# EAGLE design aeg_driver (EAGLE 9.6.0)
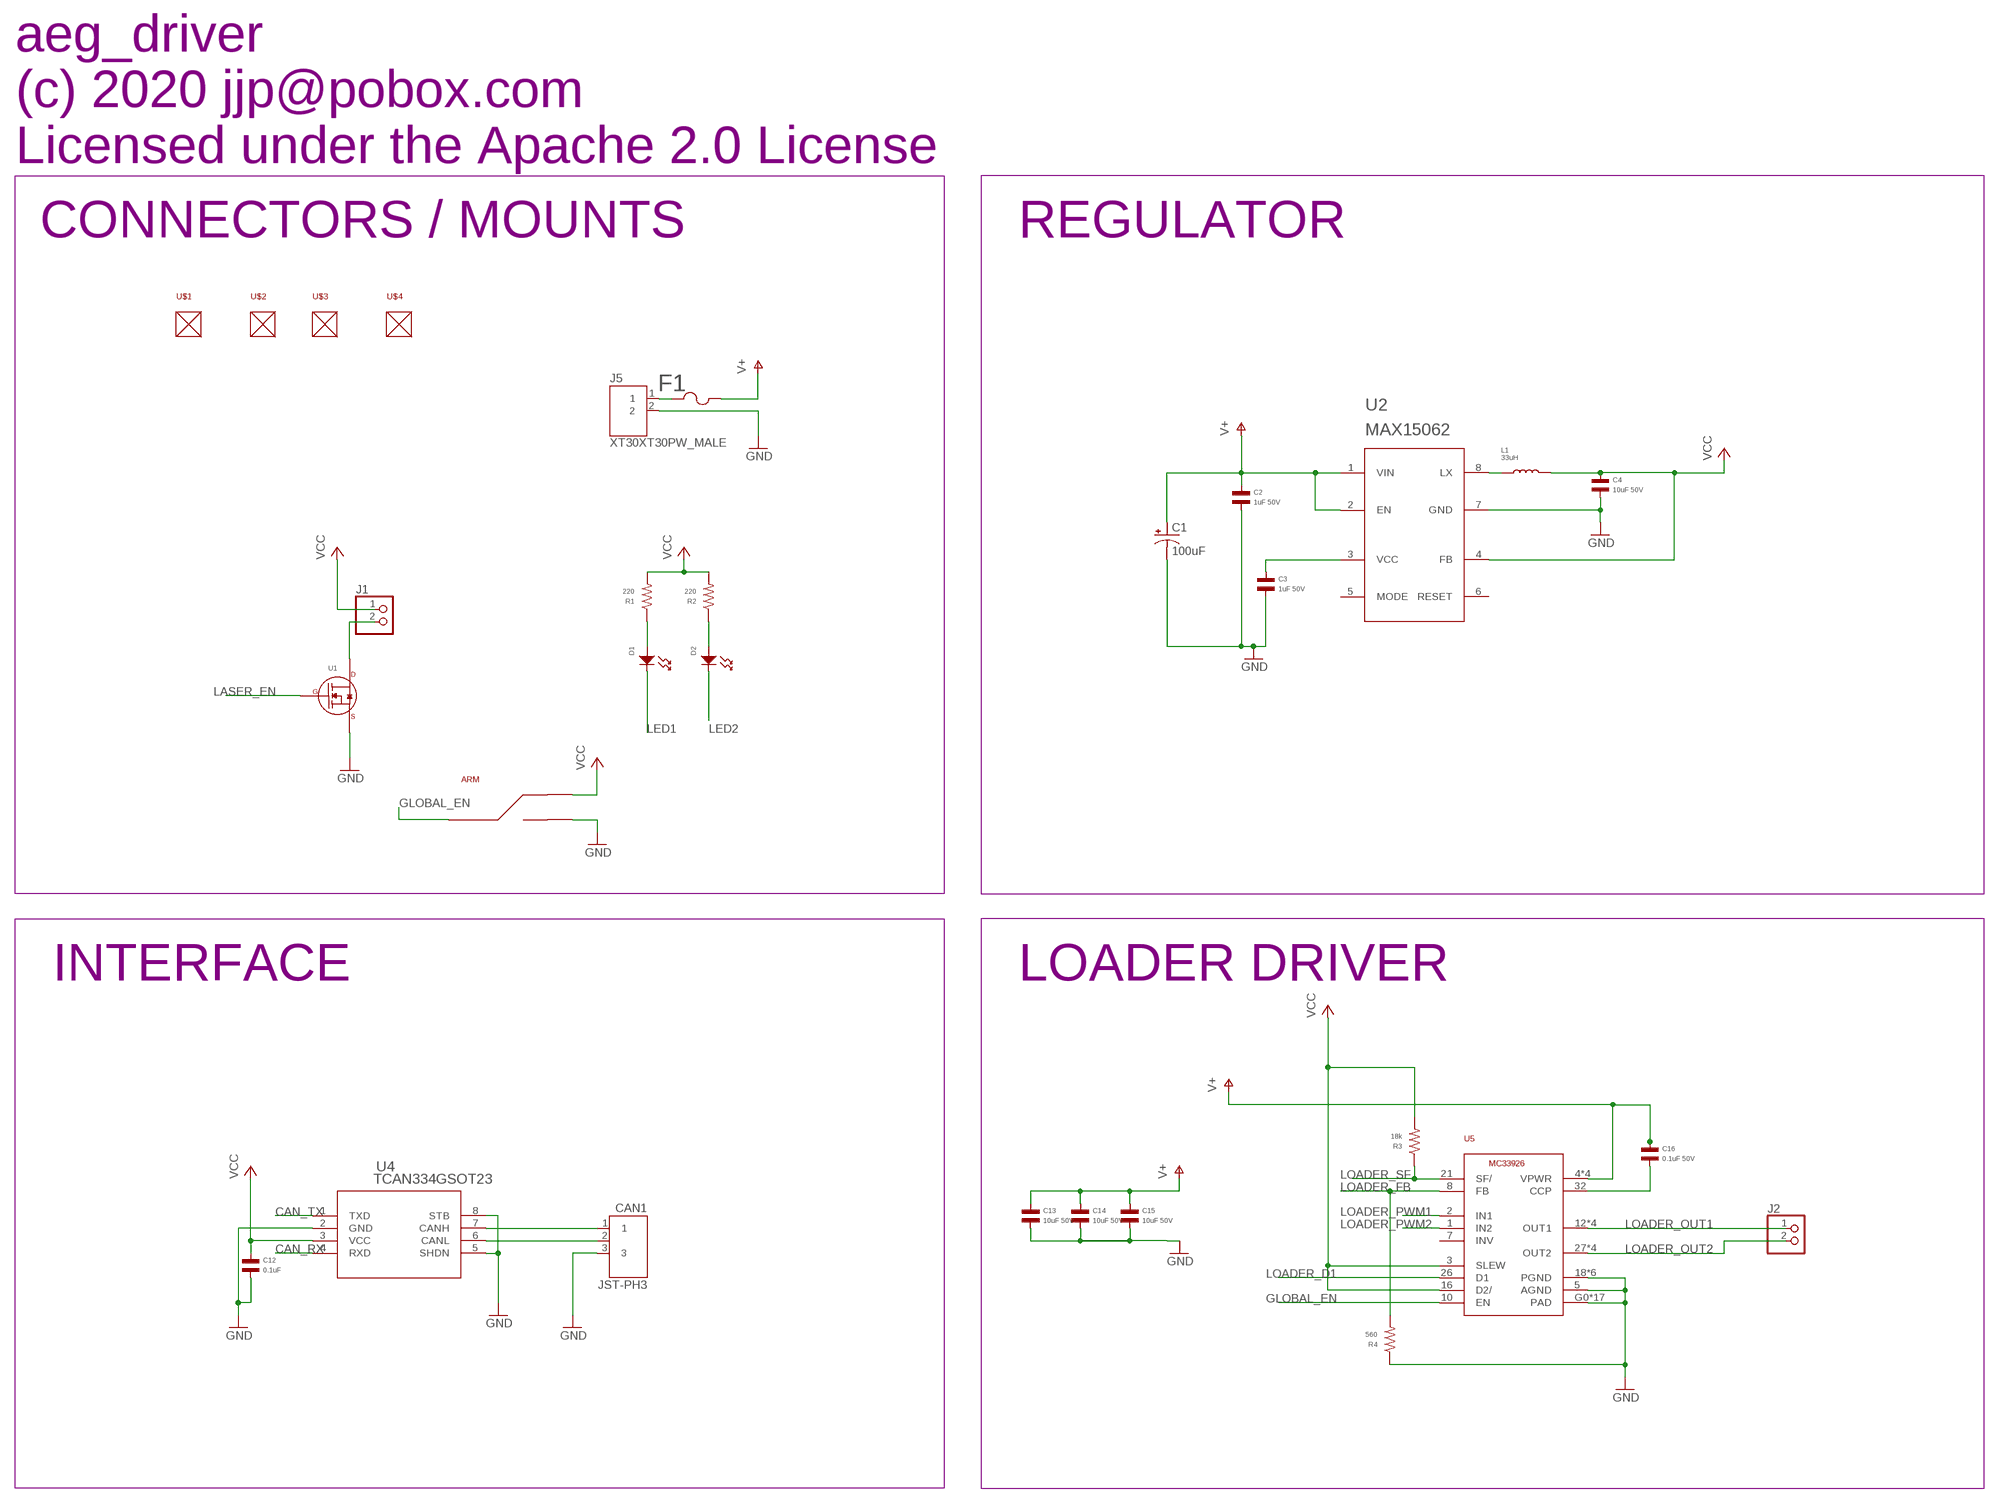
[diagram p0: schematic, sheet 1, part 1 of 2]
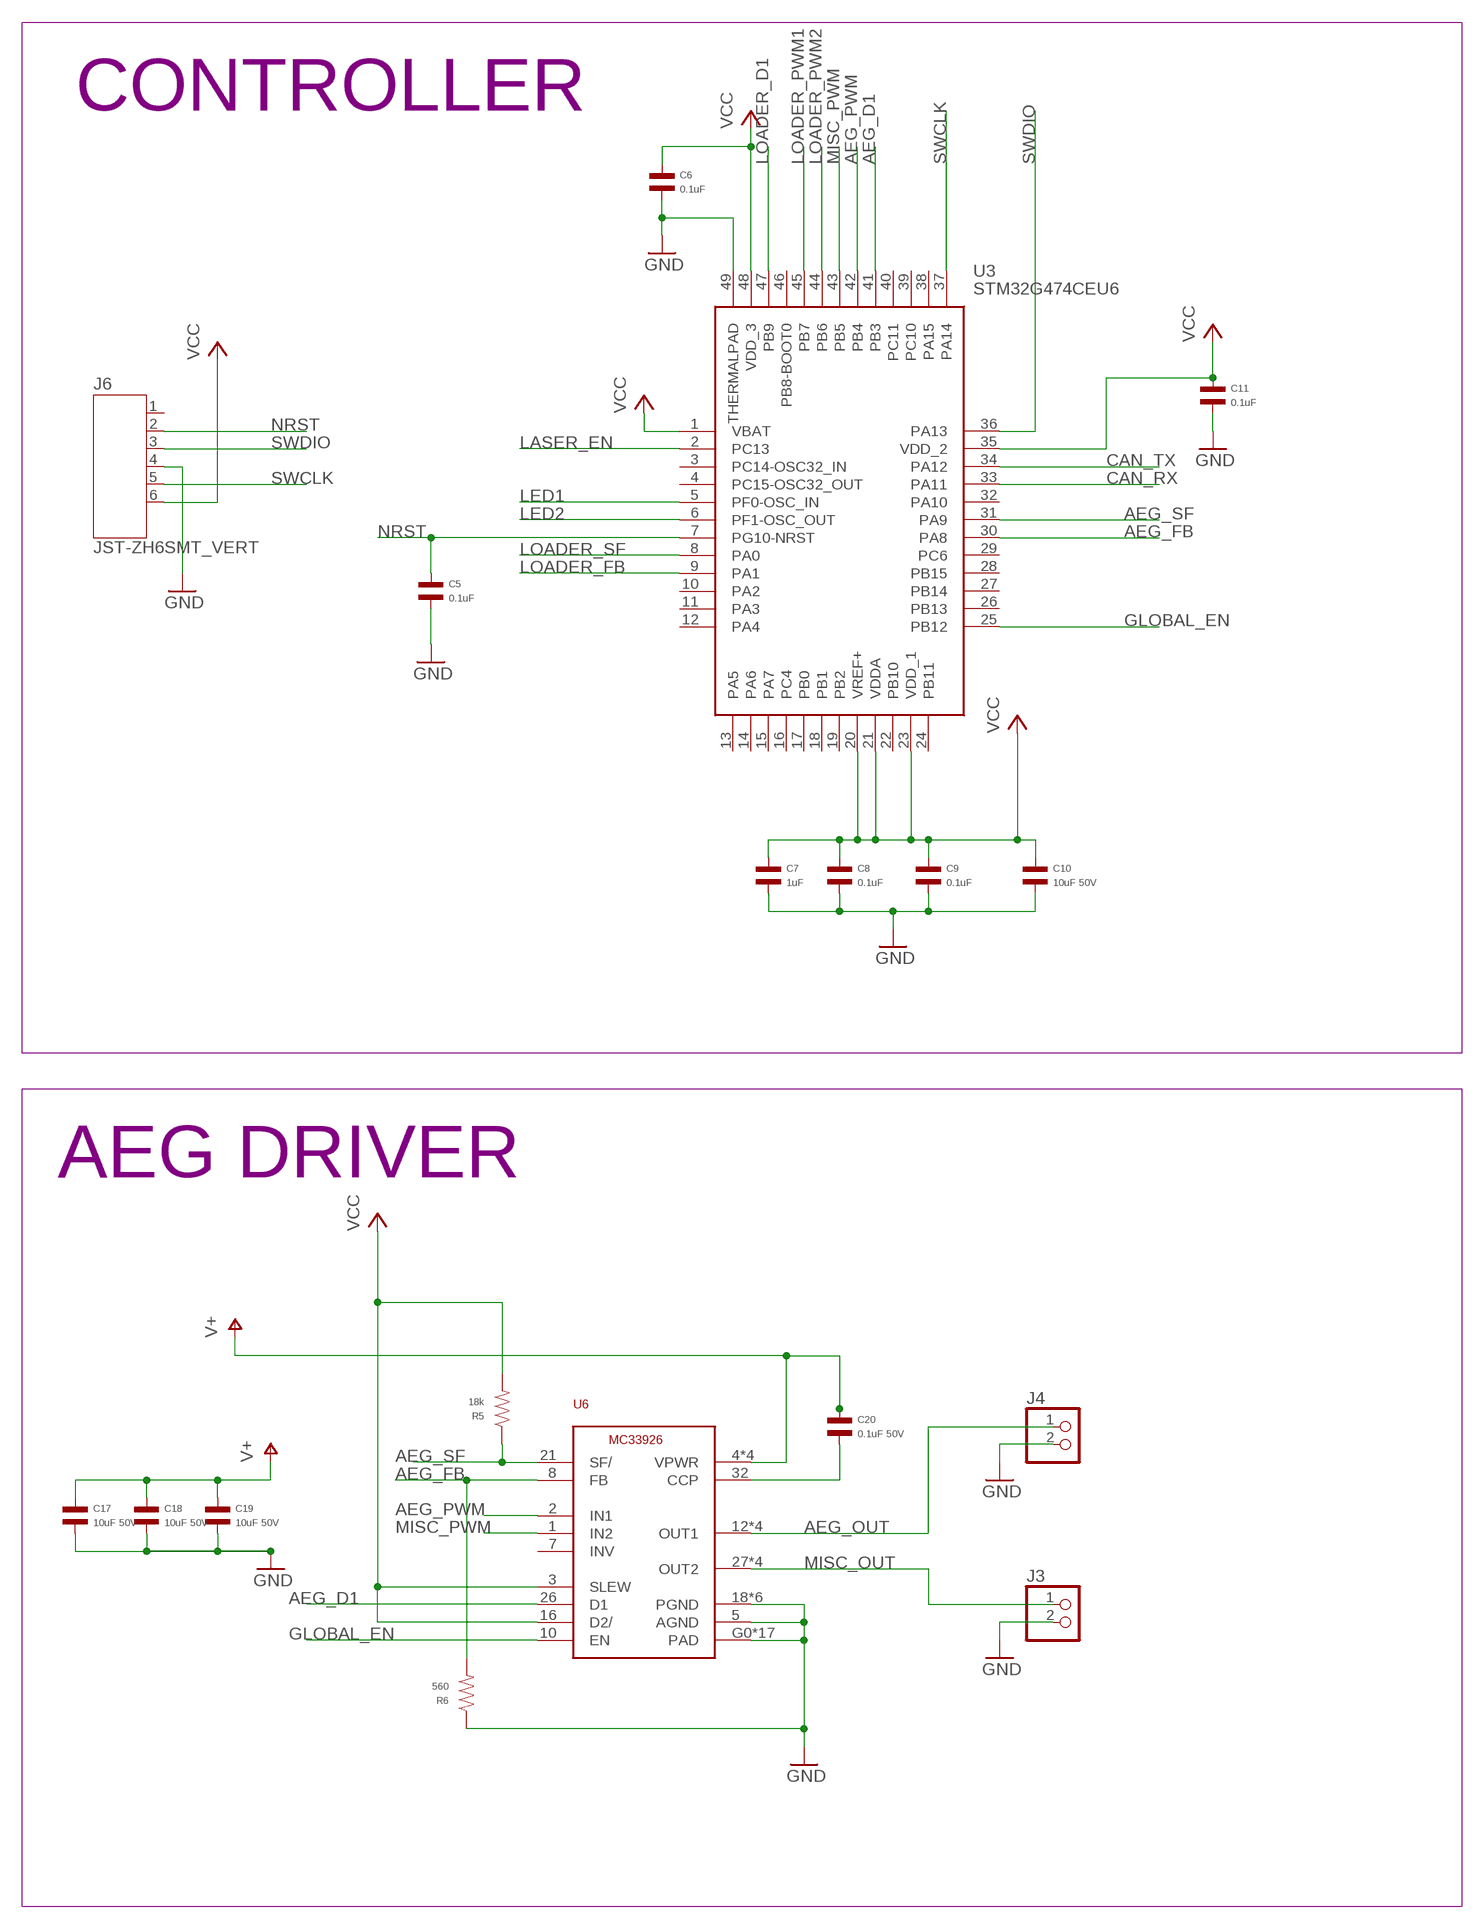
[diagram p1: schematic, sheet 1, part 2 of 2]

## Parts
ARM  SLIDE_SWITCHJS_SUB_SWITCH  [JS_SUB_SWITCH]
C1  100uF  CPOL-USFT_D  [PANASONIC_FT_CAP_D]
C2  1uF 50V  CAPACITOR_NP_0603  [C0603]
C3  1uF 50V  CAPACITOR_NP_0603  [C0603]
C4  10uF 50V  CAPACITOR_NP_1206  [C1206]
C5  0.1uF  CAPACITOR_NP_0402  [C0402]
C6  0.1uF  CAPACITOR_NP_0402  [C0402]
C7  1uF  CAPACITOR_NP_0402  [C0402]
C8  0.1uF  CAPACITOR_NP_0402  [C0402]
C9  0.1uF  CAPACITOR_NP_0402  [C0402]
C10  10uF 50V  CAPACITOR_NP_1206  [C1206]
C11  0.1uF  CAPACITOR_NP_0402  [C0402]
C12  0.1uF  CAPACITOR_NP_0402  [C0402]
C13  10uF 50V  CAPACITOR_NP_1206  [C1206]
C14  10uF 50V  CAPACITOR_NP_1206  [C1206]
C15  10uF 50V  CAPACITOR_NP_1206  [C1206]
C16  0.1uF 50V  CAPACITOR_NP_0402  [C0402]
C17  10uF 50V  CAPACITOR_NP_1206  [C1206]
C18  10uF 50V  CAPACITOR_NP_1206  [C1206]
C19  10uF 50V  CAPACITOR_NP_1206  [C1206]
C20  0.1uF 50V  CAPACITOR_NP_0402  [C0402]
CAN1  JST-PH3  [JST_S3B-PH-SM4-TB(LF)(SN)]
D1  LED_SINGLE-0603-RED  [LED0603]
D2  LED_SINGLE-0603-RED  [LED0603]
F1  MFU0603FF04000P100  [FUS_VISHAY_MFU0603]
J1  PINHD-1X2  [1X02]
J2  PINHD-1X2  [1X02]
J3  PINHD-1X2  [1X02]
J4  PINHD-1X2  [1X02]
J5  XT30XT30PW_MALE  [XT30PW_MALE]
J6  JST-ZH6SMT_VERT  [JST_B6B-ZR-SM4-TF(LF)(SN)]
L1  33uH  INDUCTOR_1210  [L1210]
R1  220  RESISTOR_0603  [R0603]
R2  220  RESISTOR_0603  [R0603]
R3  18k  RESISTOR_0603  [R0603]
R4  560  RESISTOR_0603  [R0603]
R5  18k  RESISTOR_0603  [R0603]
R6  560  RESISTOR_0603  [R0603]
U1  N-CHANNEL_FET_SOT-23-3  [SOT-23-3]
U2  MAX150628TDFN  [8TDFN]
U3  STM32G474CEU6  [QFN50P700X700X60-49N]
U4  TCAN334GSOT23  [SOT23-8]
U5  MC33926  [PQFN32]
U6  MC33926  [PQFN32]
U$1  MOUNT  [M2.5MOUNT]
U$2  MOUNT  [M2.5MOUNT]
U$3  MOUNT  [M2.5MOUNT]
U$4  MOUNT  [M2.5MOUNT]

## Nets
AEG_D1: U3.41(PB3) U6.26(D1)
AEG_FB: R6.P$2 U3.30(PA8) U6.8(FB)
AEG_OUT: J4.1 U6.12(OUT1) U6.13(OUT1) U6.14(OUT1) U6.15(OUT1)
AEG_PWM: U3.42(PB4) U6.2(IN1)
AEG_SF: R5.P$1 U3.31(PA9) U6.21(SF/)
CAN_N [power]: CAN1.2 U4.6(CANL)
CAN_P [power]: CAN1.1 U4.7(CANH)
CAN_RX: U3.33(PA11) U4.4(RXD)
CAN_TX: U3.34(PA12) U4.1(TXD)
GLOBAL_EN: ARM.2 U3.25(PB12) U5.10(EN) U6.10(EN)
GND: ARM.3 C1.- C2.P$2 C3.P$2 C4.P$2 C5.P$2 C6.P$2 C7.P$2 C8.P$2 C9.P$2 C10.P$2 C11.P$2 C12.P$2 C13.P$2 C14.P$2 C15.P$2 C17.P$2 C18.P$2 C19.P$2 CAN1.3 J3.2 J4.2 J5.2 J6.4 R4.P$1 R6.P$1 U1.P$2(SOURCE) U2.7(GND) U3.49(THERMALPAD) U4.2(GND) U4.5(SHDN) U4.8(STB) U5.5(AGND) U5.18(PGND) U5.19(PGND) U5.20(PGND) U5.22(PGND) U5.23(PGND) U5.24(PGND) U5.G0(PAD) U5.G1(PAD) U5.G2(PAD) U5.G3(PAD) U5.G4(PAD) U5.G5(PAD) U5.G6(PAD) U5.G7(PAD) U5.G8(PAD) U5.G9(PAD) U5.G10(PAD) U5.G11(PAD) U5.G12(PAD) U5.G13(PAD) U5.G14(PAD) U5.G15(PAD) U5.G16(PAD) U6.5(AGND) U6.18(PGND) U6.19(PGND) U6.20(PGND) U6.22(PGND) U6.23(PGND) U6.24(PGND) U6.G0(PAD) U6.G1(PAD) U6.G2(PAD) U6.G3(PAD) U6.G4(PAD) U6.G5(PAD) U6.G6(PAD) U6.G7(PAD) U6.G8(PAD) U6.G9(PAD) U6.G10(PAD) U6.G11(PAD) U6.G12(PAD) U6.G13(PAD) U6.G14(PAD) U6.G15(PAD) U6.G16(PAD)
LASER_EN: U1.P$1(GATE) U3.2(PC13)
LED1: D1.CATHODE U3.5(PF0-OSC_IN)
LED2: D2.CATHODE U3.6(PF1-OSC_OUT)
LOADER_D1: U3.47(PB9) U5.26(D1)
LOADER_FB: R4.P$2 U3.9(PA1) U5.8(FB)
LOADER_OUT1: J2.1 U5.12(OUT1) U5.13(OUT1) U5.14(OUT1) U5.15(OUT1)
LOADER_OUT2: J2.2 U5.27(OUT2) U5.28(OUT2) U5.29(OUT2) U5.30(OUT2)
LOADER_PWM1: U3.45(PB7) U5.2(IN1)
LOADER_PWM2: U3.44(PB6) U5.1(IN2)
LOADER_SF: R3.P$1 U3.8(PA0) U5.21(SF/)
LX: L1.P$1 U2.8(LX)
MISC_OUT: J3.1 U6.27(OUT2) U6.28(OUT2) U6.29(OUT2) U6.30(OUT2)
MISC_PWM: U3.43(PB5) U6.1(IN2)
N$1: C20.P$2 U6.32(CCP)
N$2: J1.2 U1.P$3(DRAIN)
N$3: F1.1 J5.1
N$5: C16.P$2 U5.32(CCP)
N$13: C3.P$1 U2.3(VCC)
N$39: D1.ANODE R1.P$1
N$40: D2.ANODE R2.P$1
NRST: C5.P$1 J6.2 U3.7(PG10-NRST)
SWCLK: J6.5 U3.37(PA14)
SWDIO: J6.3 U3.36(PA13)
V+: C1.+ C2.P$1 C13.P$1 C14.P$1 C15.P$1 C16.P$1 C17.P$1 C18.P$1 C19.P$1 C20.P$1 F1.2 U2.1(VIN) U2.2(EN) U5.4(VPWR) U5.6(VPWR) U5.11(VPWR) U5.31(VPWR) U6.4(VPWR) U6.6(VPWR) U6.11(VPWR) U6.31(VPWR)
VCC [power]: ARM.1 C4.P$1 C6.P$1 C7.P$1 C8.P$1 C9.P$1 C10.P$1 C11.P$1 C12.P$1 J1.1 J6.6 L1.P$2 R1.P$2 R2.P$2 R3.P$2 R5.P$2 U2.4(FB) U3.1(VBAT) U3.20(VREF+) U3.21(VDDA) U3.23(VDD_1) U3.35(VDD_2) U3.48(VDD_3) U4.3(VCC) U5.3(SLEW) U5.16(D2/) U6.3(SLEW) U6.16(D2/)
Unconnected: J6.1 U2.5(MODE) U2.6(RESET) U3.3(PC14-OSC32_IN) U3.4(PC15-OSC32_OUT) U3.10(PA2) U3.11(PA3) U3.12(PA4) U3.13(PA5) U3.14(PA6) U3.15(PA7) U3.16(PC4) U3.17(PB0) U3.18(PB1) U3.19(PB2) U3.22(PB10) U3.24(PB11) U3.26(PB13) U3.27(PB14) U3.28(PB15) U3.29(PC6) U3.32(PA10) U3.38(PA15) U3.39(PC10) U3.40(PC11) U3.46(PB8-BOOT0) U5.7(INV) U6.7(INV)

## Notes on the sheet
- aeg_driver
  (c) 2020 jjp@pobox.com 
  Licensed under the Apache 2.0 License
- CONNECTORS / MOUNTS | REGULATOR | CONTROLLER
- INTERFACE | LOADER DRIVER | AEG DRIVER

## Library data of the parts
ARM = gimbal:SLIDE_SWITCH; MPN: JS102011SAQN; POPULATE: 1
C1 = aeg_driver:CPOL-US; MF: PANASONIC; MPN: EEE-FT1V101AP; POPULATE: 1
C2 C3 = mfpassives:CAPACITOR_NP: Library: MF_Passives Description: Device for Non-Polarized Capacitors. Manufacture part number (MPN) can be added via Attributes. Check https://factory.macrofab.com/parts for the house parts list.; MF: SAMSUNG; MPN: CL10A105KB8NNNC; POPULATE: 1
C4 C10 C13-C15 C17-C19 = mfpassives:CAPACITOR_NP: Library: MF_Passives Description: Device for Non-Polarized Capacitors. Manufacture part number (MPN) can be added via Attributes. Check https://factory.macrofab.com/parts for the house parts list.; MF: TDK; MPN: C3216X7R1H106K160AE; POPULATE: 1
C5 C6 C8 C9 C11 C12 = mfpassives:CAPACITOR_NP: Library: MF_Passives Description: Device for Non-Polarized Capacitors. Manufacture part number (MPN) can be added via Attributes. Check https://factory.macrofab.com/parts for the house parts list.; HOUSEPART: YES; MPN: MF-CAP-0402-0.1uF; POPULATE: 1
C7 = mfpassives:CAPACITOR_NP: Library: MF_Passives Description: Device for Non-Polarized Capacitors. Manufacture part number (MPN) can be added via Attributes. Check https://factory.macrofab.com/parts for the house parts list.; HOUSEPART: YES; MPN: MF-CAP-0402-1uF; POPULATE: 1
C16 C20 = mfpassives:CAPACITOR_NP: Library: MF_Passives Description: Device for Non-Polarized Capacitors. Manufacture part number (MPN) can be added via Attributes. Check https://factory.macrofab.com/parts for the house parts list.; MF: Walsin; MPN: 0402B104K500CT; POPULATE: 1
CAN1 = controller:JST-PH3; MF: JST; MPN: S3B-PH-SM4-TB(LF)(SN); POPULATE: 1
D1 = mfleds:LED_SINGLE: Library: MF_LEDs Description: Device for Single LED Packages. Manufacture part number (MFG#) can be added via Attributes.; HOUSEPART: YES; MPN: MF-LED-0603-RED; POPULATE: 1; URL: https://factory.macrofab.com/part/MF-LED-0603-RED; VALUE: MF-LED-0603-RED
D2 = mfleds:LED_SINGLE: Library: MF_LEDs Description: Device for Single LED Packages. Manufacture part number (MFG#) can be added via Attributes.; HOUSEPART: YES; MPN: MF-LED-0603-GREEN; POPULATE: 1; URL: https://factory.macrofab.com/part/MF-LED-0603-RED; VALUE: MF-LED-0603-RED
F1 = pi3_hat:MFU0603FF04000P100; DPN: MFU06034.00CT-ND; MF: VISHAY; MPN: MFU0603FF04000P100; POPULATE: 1; VENDOR: VISHAY
J1-J4 = pinhead:PINHD-1X2: PIN HEADER; POPULATE: 0
J5 = controller:XT30; MPN: XT30PW-M; POPULATE: 1
J6 = precharge:JST-ZH6; MF: JST; MPN: B6B-ZR-SM4-TF(LF)(SN); POPULATE: 1
L1 = mfpassives:INDUCTOR: Library: MF_Passives Description: Device for Inductors. Manufacture part number (MPN) can be added via Attributes. Check https://factory.macrofab.com/parts for the house parts list.; MF: TDK; MPN: NLFV32T-330K-EF; POPULATE: 1
R1 R2 = mfpassives:RESISTOR: Library: MF_Passives Description: Device for Resistors. Manufacture part number (MPN), Voltage, Tolerance, and Wattage Rating can be added via Attributes. Check https://factory.macrofab.com/parts for the house parts list.; HOUSEPART: YES; MPN: MF-RES-0603-220; POPULATE: 1
R3 R5 = mfpassives:RESISTOR: Library: MF_Passives Description: Device for Resistors. Manufacture part number (MPN), Voltage, Tolerance, and Wattage Rating can be added via Attributes. Check https://factory.macrofab.com/parts for the house parts list.; HOUSEPART: YES; MPN: MF-RES-0603-18K; POPULATE: 1
R4 R6 = mfpassives:RESISTOR: Library: MF_Passives Description: Device for Resistors. Manufacture part number (MPN), Voltage, Tolerance, and Wattage Rating can be added via Attributes. Check https://factory.macrofab.com/parts for the house parts list.; HOUSEPART: YES; MPN: MF-RES-0603-560; POPULATE: 1
U1 = mfdiscrete:N-CHANNEL_FET: Library: MF_Discrete_Semiconductor Description: Device for Single N-Channel Mosfet. Manufacture part number (MFG#) can be added via Attributes.; HOUSEPART: YES; MPN: MF-DSC-SOT233-BSS138; POPULATE: 1
U2 = precharge:MAX15062; MF: MAXIM; MPN: MAX15062AATA+T; POPULATE: 1
U3 = precharge:STM32G474CEU6: STMICROELECTRONICS - STM32G474CEU6 - MCU, 32BIT, 170MHZ, UFQFPN-48 Source: Datasheet <https://componentsearchengine.com/Datasheets/1/STM32G474CEU6.pdf>; DESCRIPTION: STMICROELECTRONICS - STM32G474CEU6 - MCU, 32BIT, 170MHZ, UFQFPN-48; HEIGHT: 0.6mm; MANUFACTURER_NAME: STMicroelectronics; MANUFACTURER_PART_NUMBER: STM32G474CEU6; MF: ST; MOUSER_PART_NUMBER: 511-STM32G474CEU6; MOUSER_PRICE-STOCK: https://www.mouser.com/Search/Refine.aspx?Keyword=511-STM32G474CEU6; MPN: STM32G474CEU6; POPULATE: 1
U4 = controller:TCAN334G; MF: TI; MPN: TCAN334GDCNT; POPULATE: 1
U5 U6 = gimbal:MC33926; MF: Freescale; MPN: MC33926PNBR2; POPULATE: 1
U$1-U$4 = precharge:MOUNT; POPULATE: 0

## Net classes
1 power: width 0.254 mm

## Board
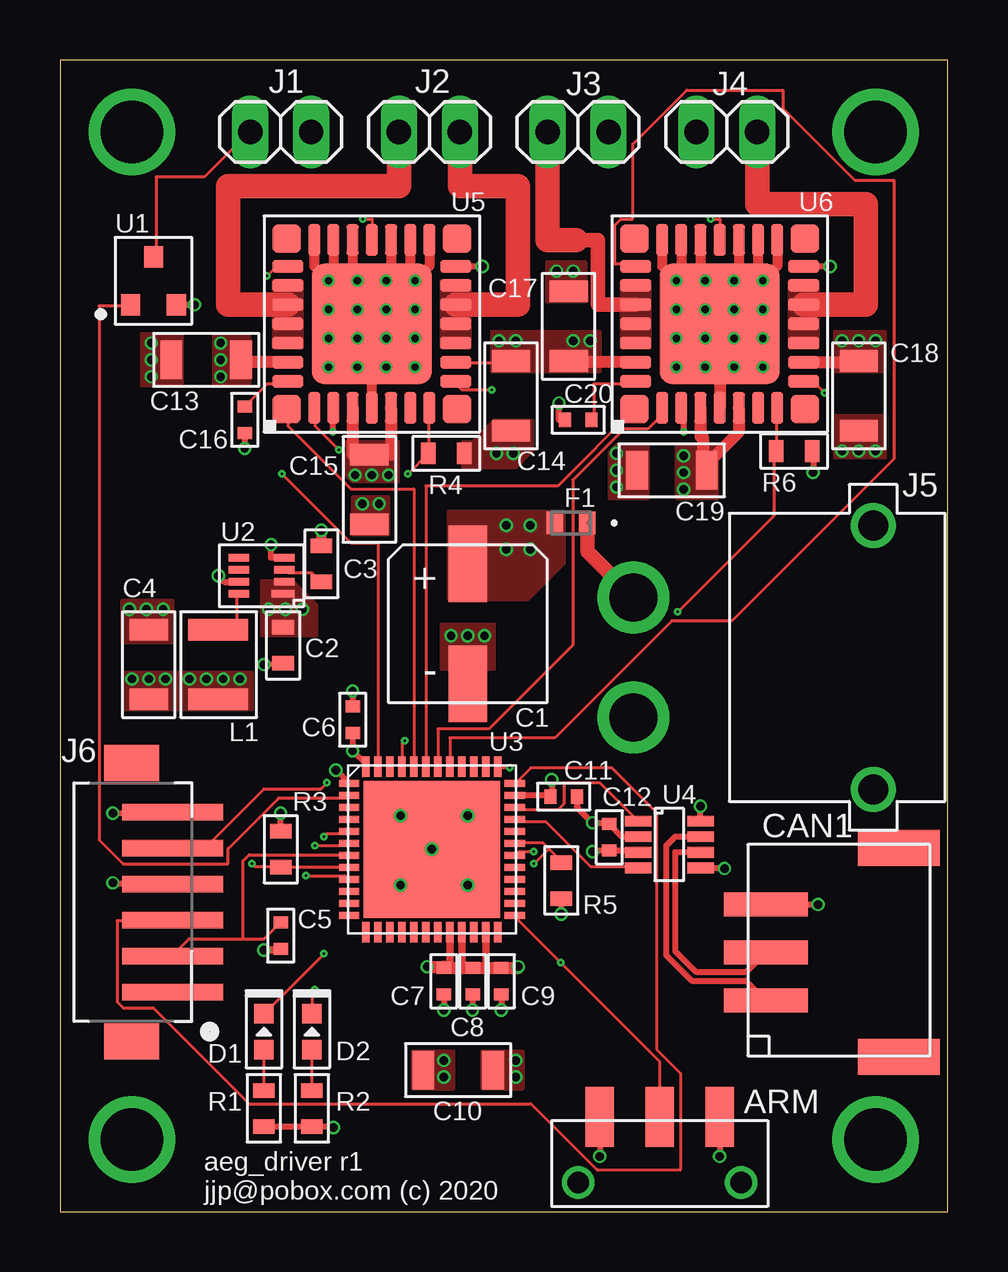
[diagram p2: board, top side]
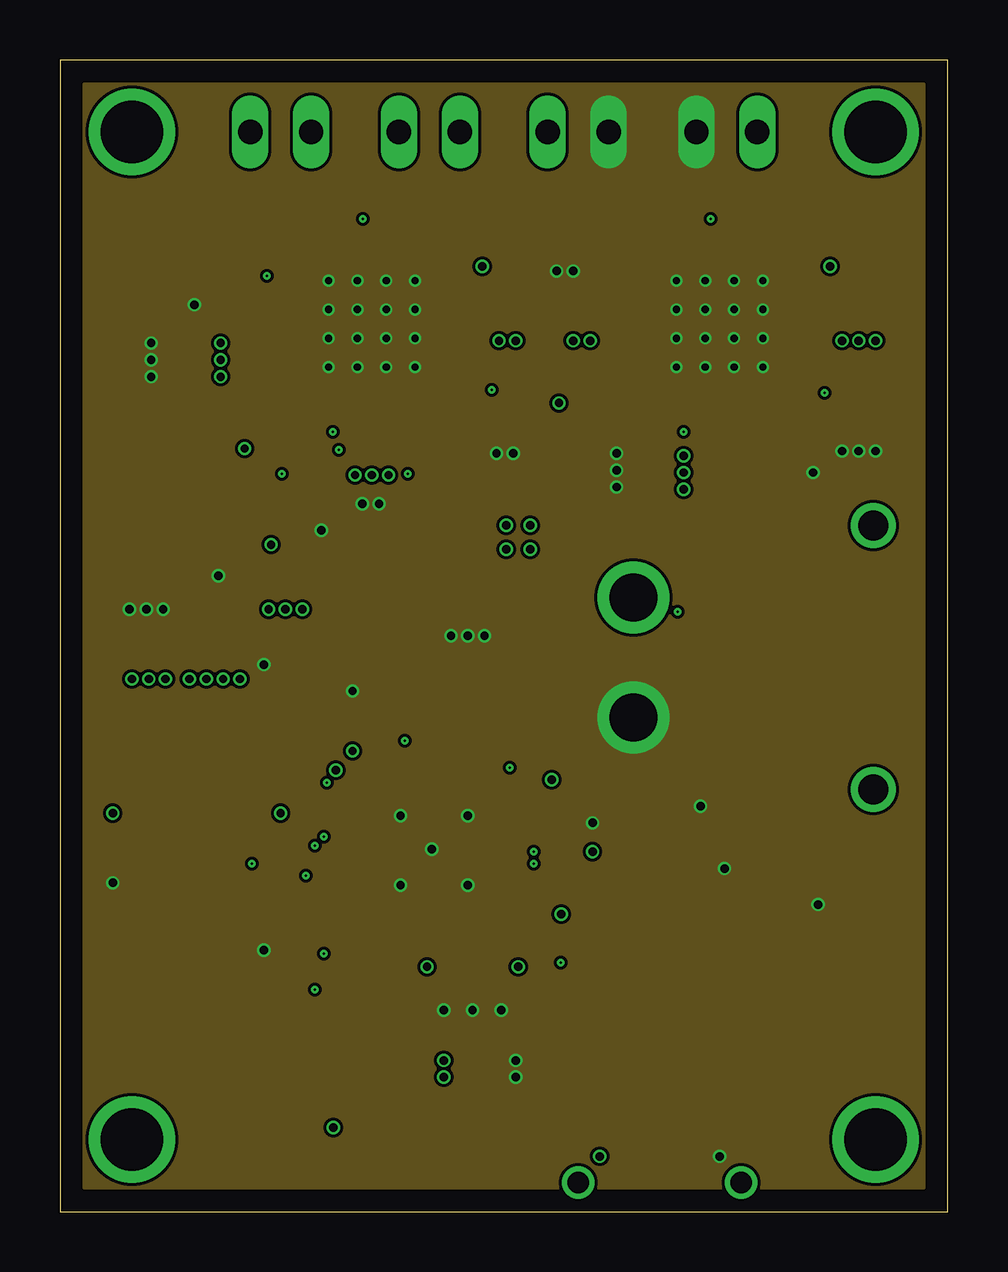
[diagram p3: board, inner layer Route2]
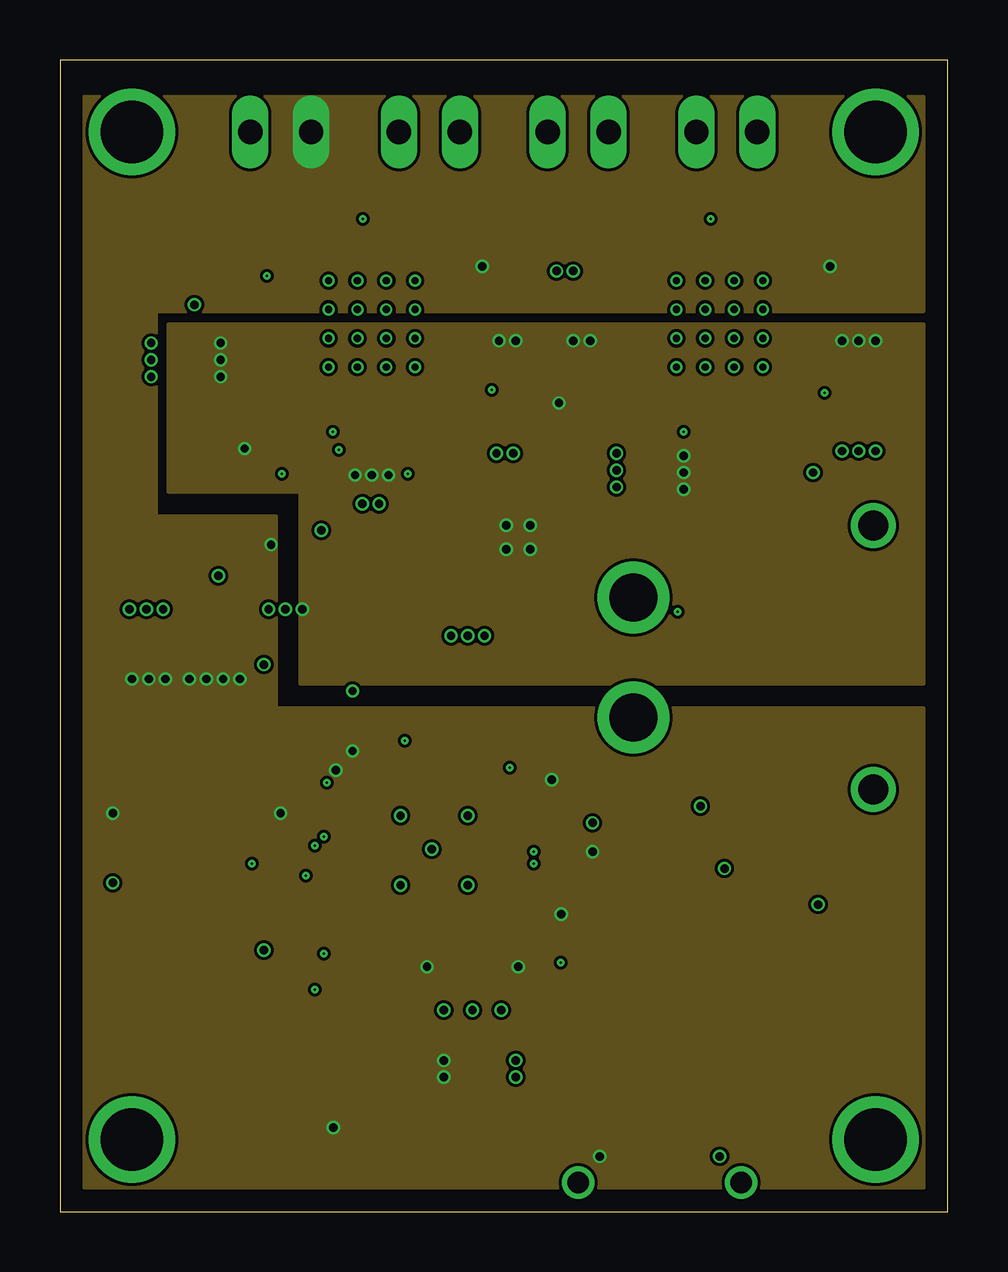
[diagram p4: board, inner layer Route15]
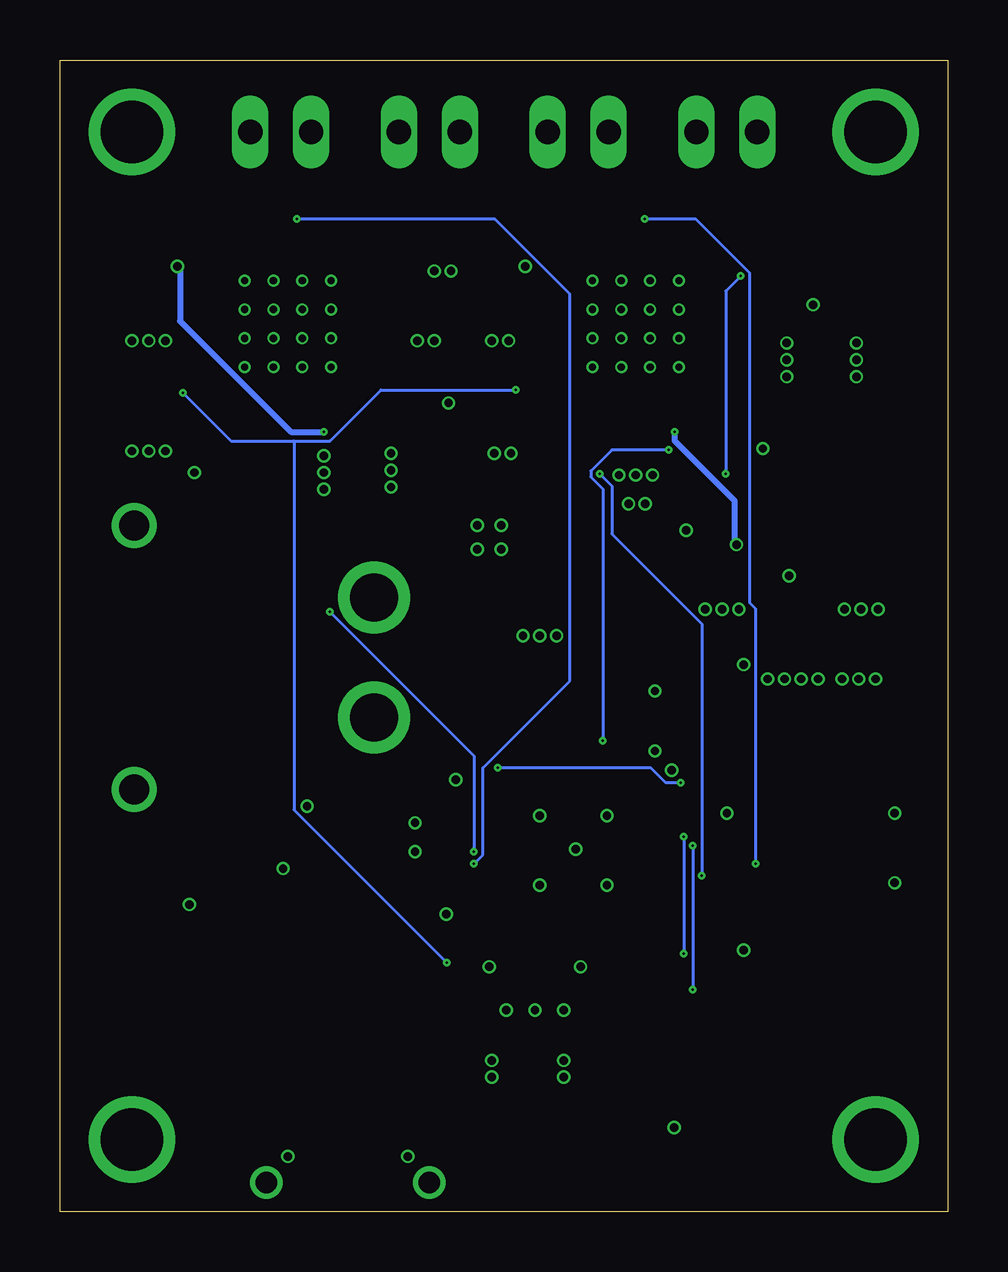
[diagram p5: board, bottom side, seen from below]

Size 37 x 48 mm. Coordinates in mm from the lower left corner, seen from the top.
Outline: 0,0 37,0 37,48 0,48 0,0
Copper layers (1*2*15*16): Top 0.035mm / dielectric 0.23mm / Route2 0.035mm / dielectric 0.93mm / Route15 0.035mm / dielectric 0.23mm / Bottom 0.035mm
Design rules "MF_4_mil_drill_4_Layer": minimum track width 5mil, minimum drill 4mil, track to track 5mil, track to pad 5mil, pad to pad 5mil, via to via 5mil, smd to smd 0mil, copper to edge 10mil, drill to drill 10mil, minimum pad ring 4mil, minimum via ring 4mil, stop-mask expansion 2mil, vias tented up to drill 25mil, thermal gap 10mil

### Footprints (pad centres in the part's own frame; a part is rotated, then mirrored left to right if it is on the bottom)
JS_SUB_SWITCH = smd 1.2 x 2.5: 1 -2.5,2.75; 2 0,2.75; 3 2.5,2.75 | drill 0.9: G0 -3.4,0; G1 3.4,0
PANASONIC_FT_CAP_D = smd 1.6 x 3.2: + 0,-2.5; - 0,2.5
C0603 = smd 0.6 x 0.9: P$1 -0.75,0; P$2 0.75,0
C1206 = smd 0.9 x 1.6: P$1 -1.45,0; P$2 1.45,0
C0402 = smd 0.5 x 0.6: P$1 -0.55,0; P$2 0.55,0
JST_S3B-PH-SM4-TB(LF)(SN) = smd 1 x 3.5: 1 2,-2.98; 2 0,-2.98; 3 -2,-2.98 | smd 1.5 x 3.4: S1 -4.35,2.57; S2 4.35,2.57
LED0603 = smd 0.8 x 0.8: ANODE 0.75,0; CATHODE -0.75,0
FUS_VISHAY_MFU0603 = smd 0.699 x 0.94: 1 -0.679,0; 2 0.679,0
1X02 = drill 1.016 long: 1 -1.27,0; 2 1.27,0
XT30PW_MALE = drill 2: 1 -2.5,0; 2 2.5,0 | drill 1.25: M1 -5.5,10; M2 5.5,10
JST_B6B-ZR-SM4-TF(LF)(SN) = smd 0.7 x 4.2: 1 -3.75,-2; 2 -2.25,-2; 3 -0.75,-2; 4 0.75,-2; 5 2.25,-2; 6 3.75,-2 | smd 1.5 x 2.3: P1 -5.8,-0.29; P2 5.8,-0.29
L1210 = smd 0.9 x 2.5: P$1 -1.45,0; P$2 1.45,0
R0603 = smd 0.6 x 0.9: P$1 -0.75,0; P$2 0.75,0
SOT-23-3 = smd 0.8 x 0.9: P$1 -0.95,-1; P$2 0.95,-1; P$3 0,1
8TDFN = smd 0.3 x 0.95: 1 -0.75,-0.9 | smd 0.3 x 0.85: 2 -0.25,-0.95; 3 0.25,-0.95; 4 0.75,-0.95; 5 0.75,0.95; 6 0.25,0.95; 7 -0.25,0.95; 8 -0.75,0.95
QFN50P700X700X60-49N = smd 0.85 x 0.3: 1 -3.45,2.75; 2 -3.45,2.25; 3 -3.45,1.75; 4 -3.45,1.25; 5 -3.45,0.75; 6 -3.45,0.25; 7 -3.45,-0.25; 8 -3.45,-0.75; 9 -3.45,-1.25; 10 -3.45,-1.75; 11 -3.45,-2.25; 12 -3.45,-2.75; 25 3.45,-2.75; 26 3.45,-2.25; 27 3.45,-1.75; 28 3.45,-1.25; 29 3.45,-0.75; 30 3.45,-0.25; 31 3.45,0.25; 32 3.45,0.75; 33 3.45,1.25; 34 3.45,1.75; 35 3.45,2.25; 36 3.45,2.75 | smd 0.3 x 0.85: 13 -2.75,-3.45; 14 -2.25,-3.45; 15 -1.75,-3.45; 16 -1.25,-3.45; 17 -0.75,-3.45; 18 -0.25,-3.45; 19 0.25,-3.45; 20 0.75,-3.45; 21 1.25,-3.45; 22 1.75,-3.45; 23 2.25,-3.45; 24 2.75,-3.45; 37 2.75,3.45; 38 2.25,3.45; 39 1.75,3.45; 40 1.25,3.45; 41 0.75,3.45; 42 0.25,3.45; 43 -0.25,3.45; 44 -0.75,3.45; 45 -1.25,3.45; 46 -1.75,3.45; 47 -2.25,3.45; 48 -2.75,3.45 | smd 5.7 x 5.7: 49 0,0
SOT23-8 = smd 0.45 x 1.1: 1 -0.975,-1.3; 2 -0.325,-1.3; 3 0.325,-1.3; 4 0.975,-1.3; 5 0.975,1.3; 6 0.325,1.3; 7 -0.325,1.3; 8 -0.975,1.3
PQFN32 = smd 1.2 x 1.2: 1 -3.55,3.55; 9 -3.55,-3.55; 17 3.55,-3.55; 25 3.55,3.55 | smd 1.3 x 0.5: 2 -3.5,2.4; 3 -3.5,1.6; 4 -3.5,0.8; 5 -3.5,0; 6 -3.5,-0.8; 7 -3.5,-1.6; 8 -3.5,-2.4; 18 3.5,-2.4; 19 3.5,-1.6; 20 3.5,-0.8; 21 3.5,0; 22 3.5,0.8; 23 3.5,1.6; 24 3.5,2.4 | smd 0.5 x 1.3: 10 -2.4,-3.5; 11 -1.6,-3.5; 12 -0.8,-3.5; 13 0,-3.5; 14 0.8,-3.5; 15 1.6,-3.5; 16 2.4,-3.5; 26 2.4,3.5; 27 1.6,3.5; 28 0.8,3.5; 29 0,3.5; 30 -0.8,3.5; 31 -1.6,3.5; 32 -2.4,3.5 | smd 5 x 5: G0 0,0 | drill 0.305: G1 -1.8,1.8; G2 -0.6,1.8; G3 0.6,1.8; G4 1.8,1.8; G5 -1.8,0.6; G6 -0.6,0.6; G7 0.6,0.6; G8 1.8,0.6; G9 -1.8,-0.6; G10 -0.6,-0.6; G11 0.6,-0.6; G12 1.8,-0.6; G13 -1.8,-1.8; G14 -0.6,-1.8; G15 0.6,-1.8; G16 1.8,-1.8
M2.5MOUNT = drill 2.6: P$1 0,0

### Placement (x,y rotation side)
ARM  25,1.2 0 top
C1  17,24.5 180 top
C2  9.3,23.6 270 top
C3  10.9,27 90 top
C4  3.7,22.8 90 top
C5  9.2,11.5 270 top
C6  12.2,20.5 90 top
C7  16,9.6 270 top
C8  17.2,9.6 270 top
C9  18.4,9.6 270 top
C10  16.6,5.9 0 top
C11  21,17.3 0 top
C12  22.9,15.6 90 top
C13  6.1,35.5 180 top
C14  18.8,34 270 top
C15  12.9,30.1 270 top
C16  7.7,33 90 top
C17  21.2,36.9 90 top
C18  33.3,34 270 top
C19  25.5,30.9 180 top
C20  21.6,33 0 top
CAN1  32.4,10.8 270 top
D1  8.5,7.5 270 top
D2  10.5,7.5 270 top
F1  21.3,28.7 180 top
J1  9.2,45 180 top
J2  15.4,45 180 top
J3  21.6,45 0 top
J4  27.8,45 180 top
J5  23.9,23.1 270 top
J6  2.7,12.9 90 top
L1  6.6,22.8 270 top
R1  8.5,4.3 270 top
R2  10.5,4.3 270 top
R3  9.2,15.1 90 top
R4  16.1,31.6 180 top
R5  20.9,13.8 270 top
R6  30.6,31.7 180 top
U1  3.9,38.8 0 top
U2  8.4,26.5 90 top
U3  15.5,15.1 0 top
U4  25.4,15.3 270 top
U5  13,37 90 top
U6  27.5,37 90 top
U$1  34,45 0 top
U$2  34,3 0 top
U$3  3,3 0 top
U$4  3,45 0 top

### Tracks (layer width: path | path; a pad name or v marks a point on that pad's centre or on a via)
AEG_D1
  Top 0.127: U3.41 16.25,19.75 20.62,19.75 25.5,24.62 28,24.62 34.75,31.38 34.75,43 33.12,43 30.12,46 30.12,46.75 26.12,46.75 23.88,44.5 23.88,41.38 23.38,41.38 23.12,41.12 23.12,39.5 24,39.5 U6.26
AEG_FB  (via drill 0.1)
  Top 0.127: v19.75,15 19.12,15 19,14.88 U3.30 | v25.75,25 29.75,29 29.75,31.62 R6.P$2 29.88,31.75 29.88,33.5 U6.8
  Bottom 0.127: v19.75,15 19.75,19 v25.75,25
AEG_OUT
  Top 1.016: J4.1 29.07,42 33.6,42 33.6,37.8 U6.14
  pour Top (no thermals): 30.4,38.8 31.6,38.8 31.6,36 30.4,36
AEG_PWM
  Top 0.127: U3.42 15.75,20.12 17.88,20.12 21.38,23.62 21.38,30.5 23.5,32.62 24.5,32.62 25,33.12 25,33.5 U6.2
AEG_SF  (via drill 0.1)
  Top 0.127: 20.38,15.12 20.88,14.62 R5.P$1 | 20.38,15.12 20.12,15.38 19,15.38 U3.31 | U6.21 27.5,41.38 v27.12,41.38 | 20.38,15.12 v19.75,14.5
  Bottom 0.127: v27.12,41.38 18.88,41.38 15.75,38.25 15.75,22.12 19.38,18.5 19.38,14.88 v19.75,14.5
CAN_N
  Top 0.254: U4.6 25.64,14.97 25.64,10.86 26.5,10 28.62,10 CAN1.2
CAN_P
  Top 0.254: U4.7 25.64,15.62 25.26,15.24 25.26,10.7 26.34,9.62 28.6,9.62 CAN1.1
CAN_RX
  Top 0.127: U3.33 19,16.25 20.25,16.25 22.12,14.38 24,14.38 U4.4
CAN_TX
  Top 0.127: U4.1 22.5,17.88 21,17.88 21,17 20.75,16.75 19,16.75 U3.34
GLOBAL_EN  (via drill 0.1)
  Top 0.127: ARM.2 25,6.25 v20.88,10.38 19,12.25 U3.25 | v18,34.25 16.75,34.25 16.5,34.5 U5.10 | v31.88,34.12 31.5,34.5 31,34.5 U6.10
  Bottom 0.127: v18,34.25 23.62,34.25 25.75,32.12 27.25,32.12 | 27.25,32.12 29.88,32.12 v31.88,34.12 | v20.88,10.38 27.25,16.75 27.25,32.12
GND  (via drill 0.35)
  Top 0.127: U6.G0 26.9,37 U6.G7 | U5.G0 12.4,37 U5.G7
  Top 0.254: ARM.3 v27.5,2.3 | C7.P$2 v16,8.4 | C8.P$2 v17.2,8.4 | C9.P$2 v18.4,8.4 | J6.4 2.2,13.65 v2.2,13.7 | C11.P$2 21.55,16.85 v22.2,16.2 22.85,16.2 C12.P$2 23.43,15.62 U4.2 | U4.8 v26.7,16.9 | U4.5 27.68,14.32 v27.7,14.3 | CAN1.3 v31.6,12.8 | v12.2,21.7 C6.P$2 | C2.P$2 9.3,22.8 v8.5,22.8 | v6.6,26.5 6.85,26.25 U2.7 | R6.P$1 31.4,31.65 v31.4,30.8 | U1.P$2 v5.6,37.8
  Top 0.305: C5.P$2 9.2,10.9 v8.5,10.9
  Top 0.406: U6.24 25.1,39.4 U6.G4 25.9,39 U6.23 | U6.22 26.7,39 U6.G8 | U6.20 28.3,39 U6.G12 | U6.19 29.1,39 U6.G16 29.9,39.4 U6.18 | U5.18 15.4,39.4 U5.G16 14.6,39 U5.19 | U5.20 13.8,39 U5.G12 | U5.22 12.2,39 U5.G8 | U5.23 11.4,39 U5.G4 10.6,39.4 U5.24 | U5.5 13,34.6 U5.G9 | C3.P$2 v10.9,28.4
  Top 0.508: U6.G0 U6.5
  other vias: 19,6.3 19,5.6 15.5,15.1 14.2,16.5 17,16.5 17,13.6 14.2,13.6 4.3,25.1 3.6,25.1 2.9,25.1 16.3,24 17,24 17.7,24 33.3,31.7 34,31.7 32.6,31.7 23.2,31.6 23.2,30.9 23.2,30.2 20.7,39.2 21.4,39.2 3.8,35.5 3.8,36.2 3.8,34.8 18.2,31.6 18.9,31.6 13.3,29.5 12.6,29.5
  pour Route2 (no thermals): 1,47 36,47 36,1 1,1
  pour Top (no thermals): 17.6,6.7 19.3,6.7 19.3,5.1 17.6,5.1
  pour Top (no thermals): 2.6,25.5 4.7,25.5 4.7,23.7 2.6,23.7
  pour Top (no thermals): 15.9,24.5 18.1,24.5 18.1,22.6 15.9,22.6
  pour Top (no thermals): 32.3,33.2 34.4,33.2 34.4,31.4 32.3,31.4
  pour Top (no thermals): 22.9,32 24.5,32 24.5,29.7 22.9,29.7
  pour Top (no thermals): 20.3,39.6 21.9,39.6 21.9,37.9 20.3,37.9
  pour Top (no thermals): 3.4,36.6 5.1,36.6 5.1,34.4 3.4,34.4
  pour Top (no thermals): 16.8,32.1 17.2,32.1 18.1,33 19.7,33 19.7,31.7 19,31 16.8,31
  pour Top (no thermals): 12.2,29.8 13.7,29.8 13.7,28.2 12.2,28.2
LASER_EN
  Top 0.127: U3.2 12,17.25 9.12,17.25 7,15.12 7,14.5 2.62,14.5 1.62,15.5 1.62,37.75 2.88,37.75 U1.P$1
LED1  (via drill 0.1)
  Top 0.127: v11,10.75 D1.CATHODE | v11,15.62 11.12,15.75 12,15.75 U3.5
  Bottom 0.127: v11,15.62 v11,10.75
LED2  (via drill 0.1)
  Top 0.127: D2.CATHODE 10.5,9.25 v10.62,9.25 | v10.62,15.25 12,15.25 U3.6
  Bottom 0.127: v10.62,15.25 v10.62,9.25
LOADER_D1  (via drill 0.1)
  Top 0.127: U3.47 13.25,27.88 12.12,27.88 v9.25,30.75 | v8.62,39 9,39.38 9.5,39.38 U5.26
  Bottom 0.127: v9.25,30.75 9.25,38.38 v8.62,39
LOADER_FB  (via drill 0.1)
  Top 0.127: v10.25,14 11.88,14 12,13.88 U3.9 | v14.5,30.75 R4.P$2 15.38,31.62 15.38,33.5 U5.8
  Bottom 0.127: v10.25,14 10.25,24.5 14,28.25 14,30.25 v14.5,30.75
LOADER_OUT1
  Top 1.016: J2.1 16.67,42.74 19.1,42.74 19.1,37.8 U5.14
  pour Top (no thermals): 15.9,38.8 17.1,38.8 17.1,36 15.9,36
LOADER_OUT2
  Top 1.016: J2.2 14.13,42.74 7,42.74 7,37.8 U5.28
  pour Top (no thermals): 8.9,38.8 10.1,38.8 10.1,36 8.9,36
LOADER_PWM1  (via drill 0.1)
  Top 0.127: U3.45 14.25,19.62 v14.38,19.62 | v11.62,31.75 10.62,32.75 10.62,33.5 U5.2
  Bottom 0.127: v14.38,19.62 14.38,30.12 14.88,30.62 14.88,30.88 14,31.75 v11.62,31.75
LOADER_PWM2
  Top 0.127: U3.44 14.75,30.12 12.12,30.12 9.5,32.75 9.5,33.38 U5.1
LOADER_SF  (via drill 0.1)
  Top 0.127: U3.8 12,14.38 9.25,14.38 R3.P$1 9.12,14.38 8.12,14.38 v8,14.5 | U5.21 13,41.38 v12.62,41.38
  Bottom 0.127: v12.62,41.38 10.5,41.38 8.25,39.12 8.25,25.38 8,25.12 v8,14.5
LX
  Top 0.127: L1.P$1 7.38,24.25 7.38,25.75 U2.8
MISC_OUT
  Top 0.61: 21.5,40.5 22.43,40.5 22.43,37.8 U6.28
  Top 1.016: J3.1 20.33,40.5 21.5,40.5
  pour Top (no thermals): 23.4,38.8 24.6,38.8 24.6,36 23.4,36
MISC_PWM
  Top 0.127: U3.43 15.25,30.25 20.75,30.25 U6.1
N$1
  Top 0.127: C20.P$2 22.25,33 22.25,34.5 24,34.5 U6.32
N$2
  Top 0.127: U1.P$3 4,39.88 4,43.12 6,43.12 7.88,45 J1.2
N$3
  Top 0.61: J5.1 21.98,27.52 F1.1
N$5
  Top 0.127: C16.P$2 7.75,33.62 8.62,34.5 9.5,34.5 U5.32
N$13
  Top 0.127: U2.3 9.38,26.75 9.5,26.62 10.5,26.62 10.88,26.25 C3.P$1
N$39
  Top 0.127: R1.P$1 D1.ANODE
N$40
  Top 0.127: R2.P$1 D2.ANODE
NRST
  Top 0.127: 7.62,11.38 5.38,11.38 4.75,10.75 J6.2 | 7.62,11.38 8.5,11.38 9.12,12 C5.P$1 | 7.62,11.38 7.62,14.62 7.88,14.88 12,14.88 U3.7
SWCLK  (via drill 0.1)
  Top 0.127: v18.75,18.5 18.25,18.5 U3.37 | v11.12,17.88 10.88,17.62 8.5,17.62 6.12,15.25 4.75,15.25 J6.5
  Bottom 0.127: v18.75,18.5 12.38,18.5 11.75,17.88 v11.12,17.88
SWDIO
  Top 0.127: U3.36 19,17.88 19.62,18.5 23,18.5 24.88,16.62 24.88,6.75 25.88,5.75 25.88,1.75 22.38,1.75 19.62,4.5 7.88,4.5 3.88,8.5 2.62,8.5 2.38,8.75 2.38,12.12 4.62,12.12 J6.3
V+  (via drill 0.35)
  Top 0.127: 18,35.38 16.5,35.38 U5.11
  Top 0.254: C20.P$1 20.8,33 v20.8,33.7 | C16.P$1 v7.7,31.8
  Top 0.508: U6.11 33.3,35.4 C18.P$1 | U6.4 26.7,32.3 26.8,32.3 26.8,31 | 26.8,31 26.8,30.9 C19.P$1 | U6.6 28.3,32.5 26.8,31 | U6.31 21.2,35.4 C17.P$1 | U5.4 12.2,31.55 C15.P$1 13.8,31.55 U5.6 | U5.31 7.55,35.4 C13.P$1
  other vias: 8.7,25.1 9.4,25.1 10.1,25.1 18.6,28.6 19.6,28.6 18.6,27.6 19.6,27.6 26,31.5 26,30.8 26,30.1 32.6,36.3 33.3,36.3 34,36.3 21.4,36.3 22.1,36.3 19,36.3 18.3,36.3 12.3,30.7 13,30.7 13.7,30.7 6.7,36.2 6.7,35.5 6.7,34.8
  pour Route15 (no thermals): 4.5,30 4.5,37 36,37 36,22 10,22 10,30
  pour Top (no thermals): 8.4,26.3 9.7,26.3 10.7,25.3 10.7,24 8.4,24
  pour Top (no thermals): 16.2,29.2 21,29.2 21,27 19.5,25.5 16.2,25.5
  pour Top (no thermals): 25.7,31.9 27.4,31.9 27.4,29.7 25.7,29.7
  pour Top (no thermals): 32.3,36.7 34.4,36.7 34.4,35 32.3,35
  pour Top (no thermals): 18,36.7 22.5,36.7 22.5,35 18,35
  pour Top (no thermals): 11.9,32.1 14.1,32.1 14.1,30.4 11.9,30.4
  pour Top (no thermals): 6.4,36.6 7.9,36.6 7.9,34.4 6.4,34.4
VCC  (via drill 0.1, 0.35)
  Top 0.254: ARM.1 v22.5,2.3 | R1.P$2 R2.P$2 11.4,3.55 v11.4,3.5 | J6.6 4.7,16.6 v2.2,16.6 | R3.P$2 v9.2,16.6 | C6.P$1 v12.2,19.2 12.75,18.65 U3.48 | U3.1 v11.5,18.4 | v20.5,18 20.5,17.35 C11.P$1 20.4,17.35 U3.35 | v22.2,15 22.25,15.05 C12.P$1 24.02,15.05 U4.3 | v20.9,12.4 R5.P$2 | U2.4 8.8,27.25 v8.8,27.8 | U6.16 v32.1,39.4 | U5.16 v17.6,39.4 | v11.38,32.5 11.38,33.5 U5.3 | v26,32.5 26,33.5 U6.3
  Top 0.305: U3.20 16.25,10.2 16,10.2 | U3.21 16.75,10.15 16.5,10.15 | U3.23 17.75,10.15 18,10.15
  Top 0.508: v15.3,10.2 16,10.2 C7.P$1 16.5,10.15 C8.P$1 18,10.15 C9.P$1 19.1,10.15 v19.1,10.2
  Bottom 0.254: v11.38,32.5 11.38,32.12 8.88,29.62 8.88,27.88 v8.8,27.8 | v26,32.5 27.38,32.5 32,37.12 32,39.38 v32.1,39.4
  other vias: 16,6.3 16,5.6 7.5,22.2 6.8,22.2 6.1,22.2 5.4,22.2 4.4,22.2 3.7,22.2 3,22.2
  pour Route15 (no thermals): 1,29 9,29 9,21 36,21 36,1 1,1
  pour Top (no thermals): 14.7,6.7 16.4,6.7 16.4,5.1 14.7,5.1
  pour Top (no thermals): 2.7,22.5 8,22.5 8,20.9 2.7,20.9
  pour Route15 (no thermals): 1,28 1,46.5 36,46.5 36,37.5 4,37.5 4,28

### Text on the board
tPlace: aeg_driver r1 / jjp@pobox.com (c) 2020